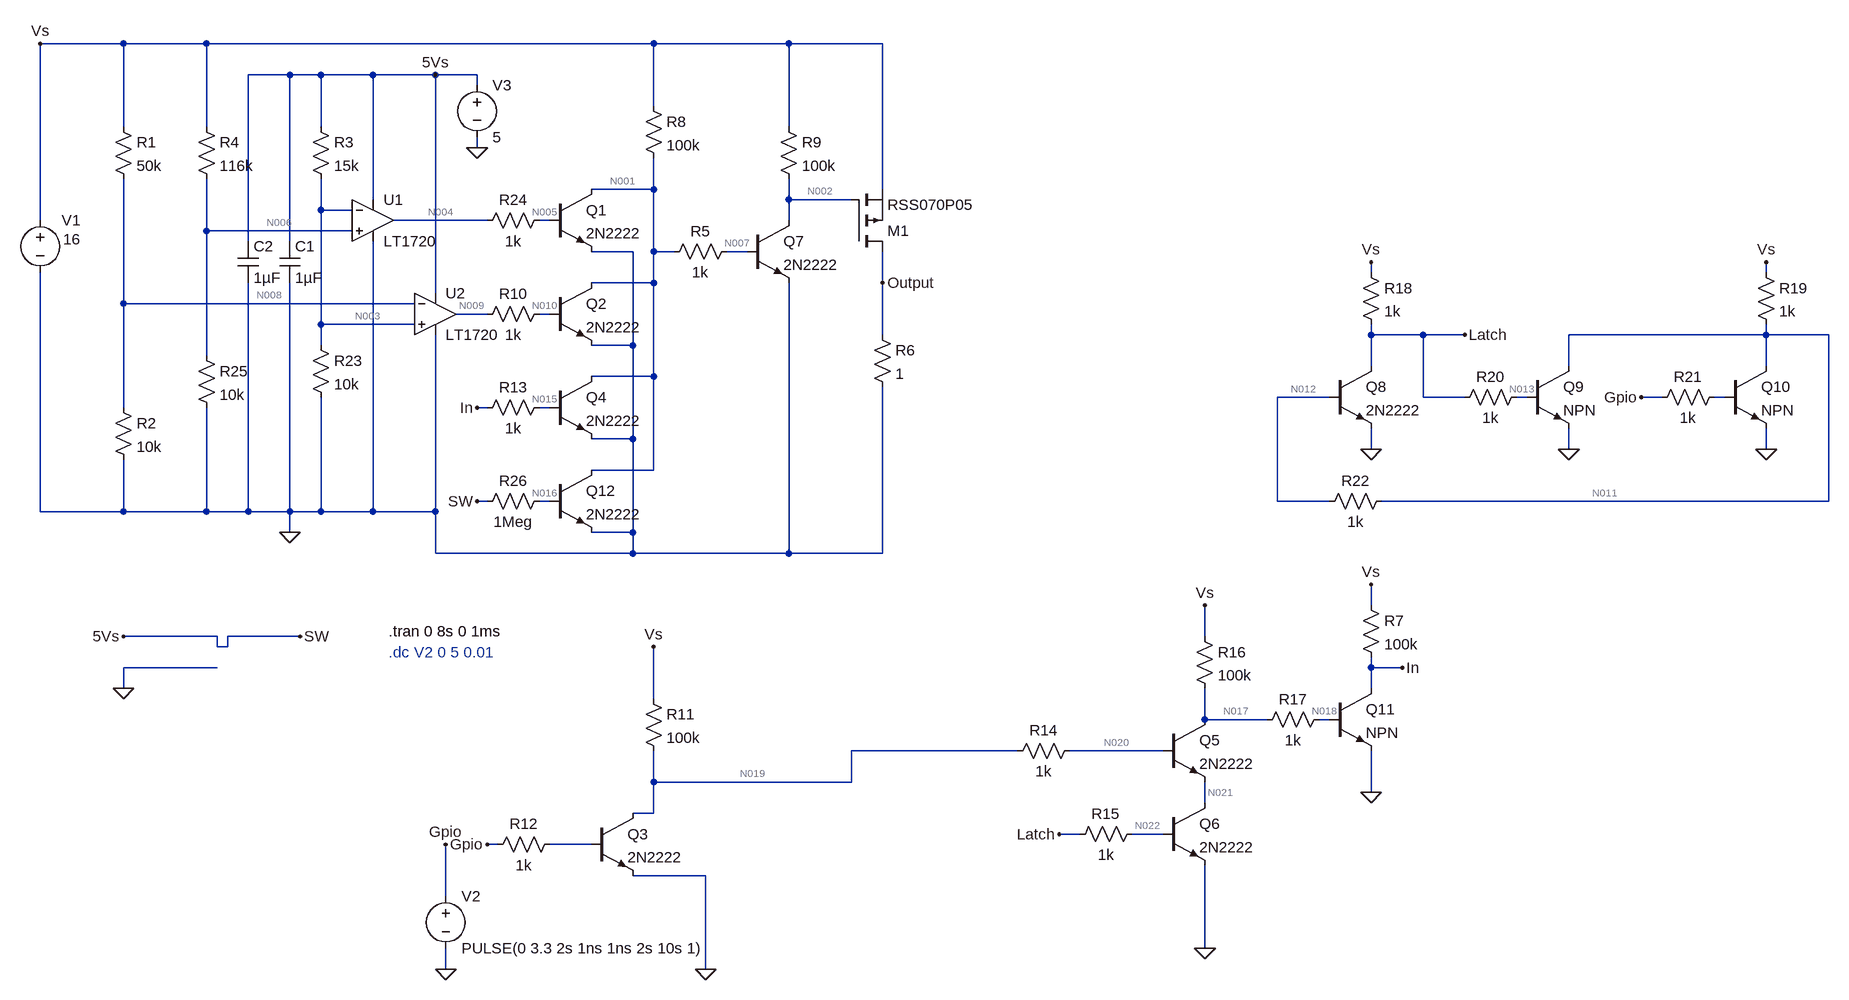
[diagram p0: schematic BatteryProtection.asc]
BatteryProtection.asc, the LTspice schematic file:
Version 4
SHEET 1 2352 1348
WIRE -320 -304 -448 -304
WIRE -192 -304 -320 -304
WIRE 496 -304 -192 -304
WIRE 704 -304 496 -304
WIRE 848 -304 704 -304
WIRE -64 -256 -128 -256
WIRE -16 -256 -64 -256
WIRE 64 -256 -16 -256
WIRE 160 -256 64 -256
WIRE 224 -256 160 -256
WIRE 224 -240 224 -256
WIRE 496 -208 496 -304
WIRE -320 -176 -320 -304
WIRE -192 -176 -192 -304
WIRE -16 -176 -16 -256
WIRE 704 -176 704 -304
WIRE 224 -144 224 -160
WIRE 496 -80 496 -128
WIRE 496 -80 400 -80
WIRE 848 -80 848 -304
WIRE 64 -64 64 -256
WIRE 704 -64 704 -96
WIRE 800 -64 704 -64
WIRE -16 -48 -16 -96
WIRE 32 -48 -16 -48
WIRE -448 -32 -448 -304
WIRE 240 -32 96 -32
WIRE 336 -32 320 -32
WIRE 704 -32 704 -64
WIRE -192 -16 -192 -96
WIRE 32 -16 -192 -16
WIRE -128 0 -128 -256
WIRE -64 0 -64 -256
WIRE 464 16 400 16
WIRE 496 16 496 -80
WIRE 528 16 496 16
WIRE 640 16 608 16
WIRE 1600 48 1600 32
WIRE 2208 48 2208 32
WIRE 496 64 496 16
WIRE 496 64 400 64
WIRE 848 64 848 16
WIRE 160 80 160 -256
WIRE -320 96 -320 -96
WIRE 128 96 -320 96
WIRE 240 112 192 112
WIRE 336 112 320 112
WIRE -16 128 -16 -48
WIRE 128 128 -16 128
WIRE 848 144 848 64
WIRE 1600 144 1600 128
WIRE 1680 144 1600 144
WIRE 1744 144 1680 144
WIRE 2208 144 2208 128
WIRE 2208 144 1904 144
WIRE 2304 144 2208 144
WIRE -16 160 -16 128
WIRE 464 160 464 16
WIRE 464 160 400 160
WIRE -192 176 -192 -16
WIRE 1600 192 1600 144
WIRE 1904 192 1904 144
WIRE 2208 192 2208 144
WIRE 496 208 496 64
WIRE 496 208 400 208
WIRE 1536 240 1456 240
WIRE 1680 240 1680 144
WIRE 1744 240 1680 240
WIRE 1840 240 1824 240
WIRE 2048 240 2016 240
WIRE 2144 240 2128 240
WIRE -320 256 -320 96
WIRE 240 256 224 256
WIRE 336 256 320 256
WIRE 464 304 464 160
WIRE 464 304 400 304
WIRE 1600 320 1600 288
WIRE 1904 320 1904 288
WIRE 2208 320 2208 288
WIRE 496 352 496 208
WIRE 496 352 400 352
WIRE 240 400 224 400
WIRE 336 400 320 400
WIRE 1456 400 1456 240
WIRE 1536 400 1456 400
WIRE 2304 400 2304 144
WIRE 2304 400 1616 400
WIRE -448 416 -448 48
WIRE -320 416 -320 336
WIRE -320 416 -448 416
WIRE -192 416 -192 256
WIRE -192 416 -320 416
WIRE -128 416 -128 64
WIRE -128 416 -192 416
WIRE -64 416 -64 64
WIRE -64 416 -128 416
WIRE -16 416 -16 240
WIRE -16 416 -64 416
WIRE 64 416 64 0
WIRE 64 416 -16 416
WIRE 160 416 160 144
WIRE 160 416 64 416
WIRE -64 448 -64 416
WIRE 464 448 464 304
WIRE 464 448 400 448
WIRE 160 480 160 416
WIRE 464 480 464 448
WIRE 464 480 160 480
WIRE 704 480 704 64
WIRE 704 480 464 480
WIRE 848 480 848 224
WIRE 848 480 704 480
WIRE 1600 560 1600 528
WIRE -176 608 -320 608
WIRE -48 608 -160 608
WIRE 1344 608 1344 560
WIRE -176 624 -176 608
WIRE -160 624 -160 608
WIRE -160 624 -176 624
WIRE -176 656 -320 656
WIRE 1600 656 1600 640
WIRE 1648 656 1600 656
WIRE -320 688 -320 656
WIRE 1600 688 1600 656
WIRE 496 704 496 624
WIRE 1344 736 1344 688
WIRE 1440 736 1344 736
WIRE 1536 736 1520 736
WIRE 1056 784 800 784
WIRE 1280 784 1136 784
WIRE 496 832 496 784
WIRE 800 832 800 784
WIRE 800 832 496 832
WIRE 1600 848 1600 784
WIRE 1344 864 1344 832
WIRE 496 880 496 832
WIRE 496 880 464 880
WIRE 1152 912 1120 912
WIRE 1280 912 1232 912
WIRE 256 928 240 928
WIRE 400 928 336 928
WIRE 576 976 464 976
WIRE 176 1008 176 928
WIRE 1344 1088 1344 960
WIRE 176 1120 176 1088
WIRE 576 1120 576 976
FLAG -64 448 0
FLAG 848 64 Output
FLAG -448 -304 Vs
FLAG 176 1120 0
FLAG 496 624 Vs
FLAG 576 1120 0
FLAG 176 928 Gpio
FLAG 240 928 Gpio
FLAG 2208 320 0
FLAG 1904 320 0
FLAG 1600 320 0
FLAG 1600 32 Vs
FLAG 2208 32 Vs
FLAG 2016 240 Gpio
FLAG 1344 1088 0
FLAG 1120 912 Latch
FLAG 1648 656 In
FLAG 224 -144 0
FLAG 224 256 In
FLAG 1744 144 Latch
FLAG 1344 560 Vs
FLAG 1600 528 Vs
FLAG 1600 848 0
FLAG 160 -256 5Vs
FLAG -320 608 5Vs
FLAG -48 608 SW
FLAG 224 400 SW
FLAG -320 688 0
SYMBOL voltage -448 -48 R0
WINDOW 3 35 45 Left 2
WINDOW 123 0 0 Left 0
WINDOW 39 0 0 Left 0
WINDOW 0 33 16 Left 2
SYMATTR Value 16
SYMATTR InstName V1
SYMBOL Comparators\\LT1720 64 -96 R0
SYMATTR InstName U1
SYMBOL Comparators\\LT1720 160 48 R0
SYMATTR InstName U2
SYMBOL res -336 -192 R0
SYMATTR InstName R1
SYMATTR Value 50k
SYMBOL res -336 240 R0
SYMATTR InstName R2
SYMATTR Value 10k
SYMBOL res -32 -192 R0
SYMATTR InstName R3
SYMATTR Value 15k
SYMBOL res 832 128 R0
SYMATTR InstName R6
SYMATTR Value 1
SYMBOL npn 336 -80 R0
SYMATTR InstName Q1
SYMATTR Value 2N2222
SYMBOL npn 336 64 R0
SYMATTR InstName Q2
SYMATTR Value 2N2222
SYMBOL res 480 -224 R0
SYMATTR InstName R8
SYMATTR Value 100k
SYMBOL res 688 -192 R0
SYMATTR InstName R9
SYMATTR Value 100k
SYMBOL pmos 800 16 M180
SYMATTR InstName M1
SYMATTR Value RSS070P05
SYMBOL voltage 176 992 R0
WINDOW 123 0 0 Left 0
WINDOW 39 0 0 Left 0
SYMATTR InstName V2
SYMATTR Value PULSE(0 3.3 2s 1ns 1ns 2s 10s 1)
SYMBOL res 240 944 R270
WINDOW 0 32 56 VTop 2
WINDOW 3 0 56 VBottom 2
SYMATTR InstName R12
SYMATTR Value 1k
SYMBOL npn 400 880 R0
SYMATTR InstName Q3
SYMATTR Value 2N2222
SYMBOL res 480 688 R0
SYMATTR InstName R11
SYMATTR Value 100k
SYMBOL npn 336 208 R0
SYMATTR InstName Q4
SYMATTR Value 2N2222
SYMBOL res 224 272 R270
WINDOW 0 32 56 VTop 2
WINDOW 3 0 56 VBottom 2
SYMATTR InstName R13
SYMATTR Value 1k
SYMBOL cap -80 0 R0
SYMATTR InstName C1
SYMATTR Value 1µF
SYMBOL cap -144 0 R0
SYMATTR InstName C2
SYMATTR Value 1µF
SYMBOL npn 1536 192 R0
SYMATTR InstName Q8
SYMATTR Value 2N2222
SYMBOL npn 1840 192 R0
SYMATTR InstName Q9
SYMBOL npn 2144 192 R0
SYMATTR InstName Q10
SYMBOL res 1584 32 R0
SYMATTR InstName R18
SYMATTR Value 1k
SYMBOL res 2192 32 R0
SYMATTR InstName R19
SYMATTR Value 1k
SYMBOL res 1728 256 R270
WINDOW 0 32 56 VTop 2
WINDOW 3 0 56 VBottom 2
SYMATTR InstName R20
SYMATTR Value 1k
SYMBOL res 2032 256 R270
WINDOW 0 32 56 VTop 2
WINDOW 3 0 56 VBottom 2
SYMATTR InstName R21
SYMATTR Value 1k
SYMBOL res 1520 416 R270
WINDOW 0 32 56 VTop 2
WINDOW 3 0 56 VBottom 2
SYMATTR InstName R22
SYMATTR Value 1k
SYMBOL npn 1280 736 R0
SYMATTR InstName Q5
SYMATTR Value 2N2222
SYMBOL npn 1280 864 R0
SYMATTR InstName Q6
SYMATTR Value 2N2222
SYMBOL res 1040 800 R270
WINDOW 0 32 56 VTop 2
WINDOW 3 0 56 VBottom 2
SYMATTR InstName R14
SYMATTR Value 1k
SYMBOL res 1136 928 R270
WINDOW 0 32 56 VTop 2
WINDOW 3 0 56 VBottom 2
SYMATTR InstName R15
SYMATTR Value 1k
SYMBOL res 1328 592 R0
SYMATTR InstName R16
SYMATTR Value 100k
SYMBOL res 1424 752 R270
WINDOW 0 32 56 VTop 2
WINDOW 3 0 56 VBottom 2
SYMATTR InstName R17
SYMATTR Value 1k
SYMBOL res -32 144 R0
SYMATTR InstName R23
SYMATTR Value 10k
SYMBOL voltage 224 -256 R0
SYMATTR InstName V3
SYMATTR Value 5
SYMBOL res -208 -192 R0
SYMATTR InstName R4
SYMATTR Value 116k
SYMBOL res -208 160 R0
SYMATTR InstName R25
SYMATTR Value 10k
SYMBOL res 624 0 R90
WINDOW 0 0 56 VBottom 2
WINDOW 3 32 56 VTop 2
SYMATTR InstName R5
SYMATTR Value 1k
SYMBOL npn 640 -32 R0
SYMATTR InstName Q7
SYMATTR Value 2N2222
SYMBOL npn 1536 688 R0
SYMATTR InstName Q11
SYMBOL res 1584 544 R0
SYMATTR InstName R7
SYMATTR Value 100k
SYMBOL res 224 128 R270
WINDOW 0 32 56 VTop 2
WINDOW 3 0 56 VBottom 2
SYMATTR InstName R10
SYMATTR Value 1k
SYMBOL res 224 -16 R270
WINDOW 0 32 56 VTop 2
WINDOW 3 0 56 VBottom 2
SYMATTR InstName R24
SYMATTR Value 1k
SYMBOL npn 336 352 R0
SYMATTR InstName Q12
SYMATTR Value 2N2222
SYMBOL res 224 416 R270
WINDOW 0 32 56 VTop 2
WINDOW 3 0 56 VBottom 2
SYMATTR InstName R26
SYMATTR Value 1Meg
TEXT 88 600 Left 2 !.tran 0 8s 0 1ms
TEXT 88 632 Left 2 ;.dc V2 0 5 0.01

The netlist it stands for:
* BatteryProtection.asc
V1 Vs 0 16
XU1 N006 N003 SW 0 N004 LT1720  ; pins In+ In- V+ V- OUT
XU2 N003 N008 SW 0 N009 LT1720  ; pins In+ In- V+ V- OUT
R1 Vs N008 50k
R2 N008 0 10k
R3 SW N003 15k
R6 Output 0 1
Q1 N001 N005 0 0 2N2222
Q2 N001 N010 0 0 2N2222
R8 Vs N001 100k
R9 Vs N002 100k
M1 Output N002 Vs Vs RSS070P05
V2 Gpio 0 PULSE(0 3.3 2s 1ns 1ns 2s 10s 1)
R12 Gpio N023 1k
Q3 N019 N023 0 0 2N2222
R11 Vs N019 100k
Q4 N001 N015 0 0 2N2222
R13 In N015 1k
C1 SW 0 1µF
C2 SW 0 1µF
Q8 Latch N012 0 0 2N2222
Q9 N011 N013 0 0 NPN
Q10 N011 N014 0 0 NPN
R18 Vs Latch 1k
R19 Vs N011 1k
R20 Latch N013 1k
R21 Gpio N014 1k
R22 N012 N011 1k
Q5 N017 N020 N021 0 2N2222
Q6 N021 N022 0 0 2N2222
R14 N019 N020 1k
R15 Latch N022 1k
R16 Vs N017 100k
R17 N017 N018 1k
R23 N003 0 10k
V3 SW 0 5
R4 Vs N006 116k
R25 N006 0 10k
R5 N007 N001 1k
Q7 N002 N007 0 0 2N2222
Q11 In N018 0 0 NPN
R7 Vs In 100k
R10 N009 N010 1k
R24 N004 N005 1k
Q12 N001 N016 0 0 2N2222
R26 SW N016 1Meg
.model NPN NPN
.model PNP PNP
.lib standard.bjt
.model NMOS NMOS
.model PMOS PMOS
.lib standard.mos
.tran 0 8s 0 1ms
* .dc V2 0 5 0.01
.lib LT1720.sub
.backanno
.end

* Results of the author's LTspice run, read from the files saved beside the schematic
* Operating Point, zero values left out:
*   V(vs) = 16 V
*   V(n003) = 2.03 V
*   V(n006) = 1.316 V
*   V(sw) = 5 V
*   V(n004) = 171.5 mV
*   V(n008) = 2.667 V
*   V(n009) = 171.5 mV
*   V(n001) = 72.61 mV
*   V(n005) = 171.5 mV
*   V(n010) = 171.5 mV
*   V(n002) = 16 V
*   V(n019) = 1.833 V
*   V(n015) = 24.34 mV
*   V(in) = 24.34 mV
*   V(latch) = 30.11 mV
*   V(n012) = 836.2 mV
*   V(n011) = 8.418 V
*   V(n013) = 30.11 mV
*   V(n017) = 1.057 V
*   V(n020) = 1.691 V
*   V(n021) = 1.057 V
*   V(n022) = 30.11 mV
*   V(n018) = 766 mV
*   V(n007) = 72.61 mV
*   V(n016) = 610 mV
*   Ic(Q1) = 6.855 pA
*   Ie(Q1) = -7.312 pA
*   Ic(Q2) = 6.855 pA
*   Ie(Q2) = -7.312 pA
*   Ic(Q3) = 1.846 pA
*   Ib(Q3) = -1.836 pA
*   Ic(Q8) = 15.97 mA
*   Ib(Q8) = 7.582 mA
*   Ie(Q8) = -23.55 mA
*   Ic(Q5) = -141.7 µA
*   Ib(Q5) = 141.7 µA
*   Ie(Q5) = -1.062 pA
*   Ic(Q6) = 1.063 pA
*   Ib(Q6) = -1 pA
*   Ic(Q7) = 16.12 pA
*   Ib(Q7) = -15.86 pA
*   Ic(Q12) = 159.3 µA
*   Ib(Q12) = 4.39 µA
*   Ie(Q12) = -163.7 µA
*   Ic(Q9) = 8.388 pA
*   Ib(Q9) = -8.358 pA
*   Ic(Q10) = 8.418 pA
*   Ib(Q10) = -8.418 pA
*   Ic(Q11) = 159.8 µA
*   Ib(Q11) = 291.1 µA
*   Ie(Q11) = -450.9 µA
*   Id(M1) = -27.14 pA
*   Is(M1) = 27.14 pA
*   I(R1) = 266.7 µA
*   I(R2) = 266.7 µA
*   I(R3) = 198 µA
*   I(R6) = 43.14 pA
*   I(R8) = 159.3 µA
*   I(R9) = 16.12 pA
*   I(R12) = -1.836 pA
*   I(R11) = 141.7 µA
*   I(R18) = 15.97 mA
*   I(R19) = 7.582 mA
*   I(R20) = -8.358 pA
*   I(R21) = -8.418 pA
*   I(R22) = -7.582 mA
*   I(R14) = 141.7 µA
*   I(R15) = -1 pA
*   I(R16) = 149.4 µA
*   I(R17) = 291.1 µA
*   I(R23) = 203 µA
*   I(R4) = 126.6 µA
*   I(R25) = 131.6 µA
*   I(R5) = 15.86 pA
*   I(R7) = 159.8 µA
*   I(R26) = 4.39 µA
*   I(V1) = -24.56 mA
*   I(V2) = 10.25 pA
*   I(V3) = -8.203 mA
*   Ix(u1:1) = -5 µA
*   Ix(u1:2) = -100 pA
*   Ix(u1:3) = 4 mA
*   Ix(u1:4) = -3.995 mA
*   Ix(u1:5) = 4.19 pA
*   Ix(u2:1) = -5 µA
*   Ix(u2:2) = -100 pA
*   Ix(u2:3) = 4 mA
*   Ix(u2:4) = -3.995 mA
*   Ix(u2:5) = 4.19 pA
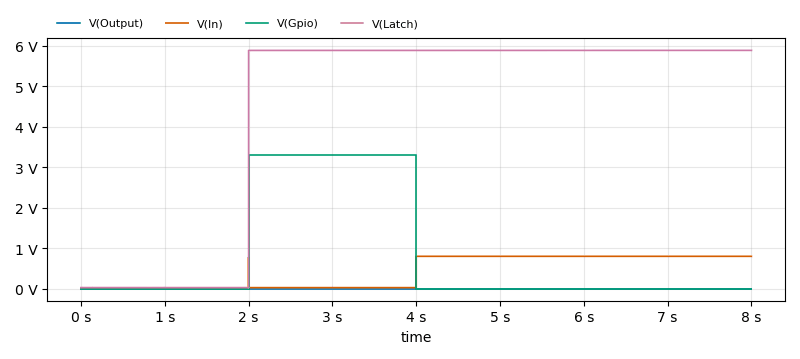
[diagram p1: Transient Analysis of BatteryProtection.asc, plotted from the saved traces]
* Transient Analysis, 1 run:
*   V(Output): min -242.8 nV, max 141.7 nV, average 44.41 pV, rms 49.79 pV, last 43.14 pV
*   V(In): min 22.56 mV, max 801.3 mV, average 414 mV, rms 566.9 mV, last 801.3 mV
*   V(Gpio): min 0 V, max 3.3 V, average 825 mV, rms 1.65 V, last 0 V
*   V(Latch): min 22.8 mV, max 5.881 V, average 4.418 V, rms 5.093 V, last 5.881 V